# EAGLE schematic FECIW5SIN365UPQ (EAGLE 7.5.0)
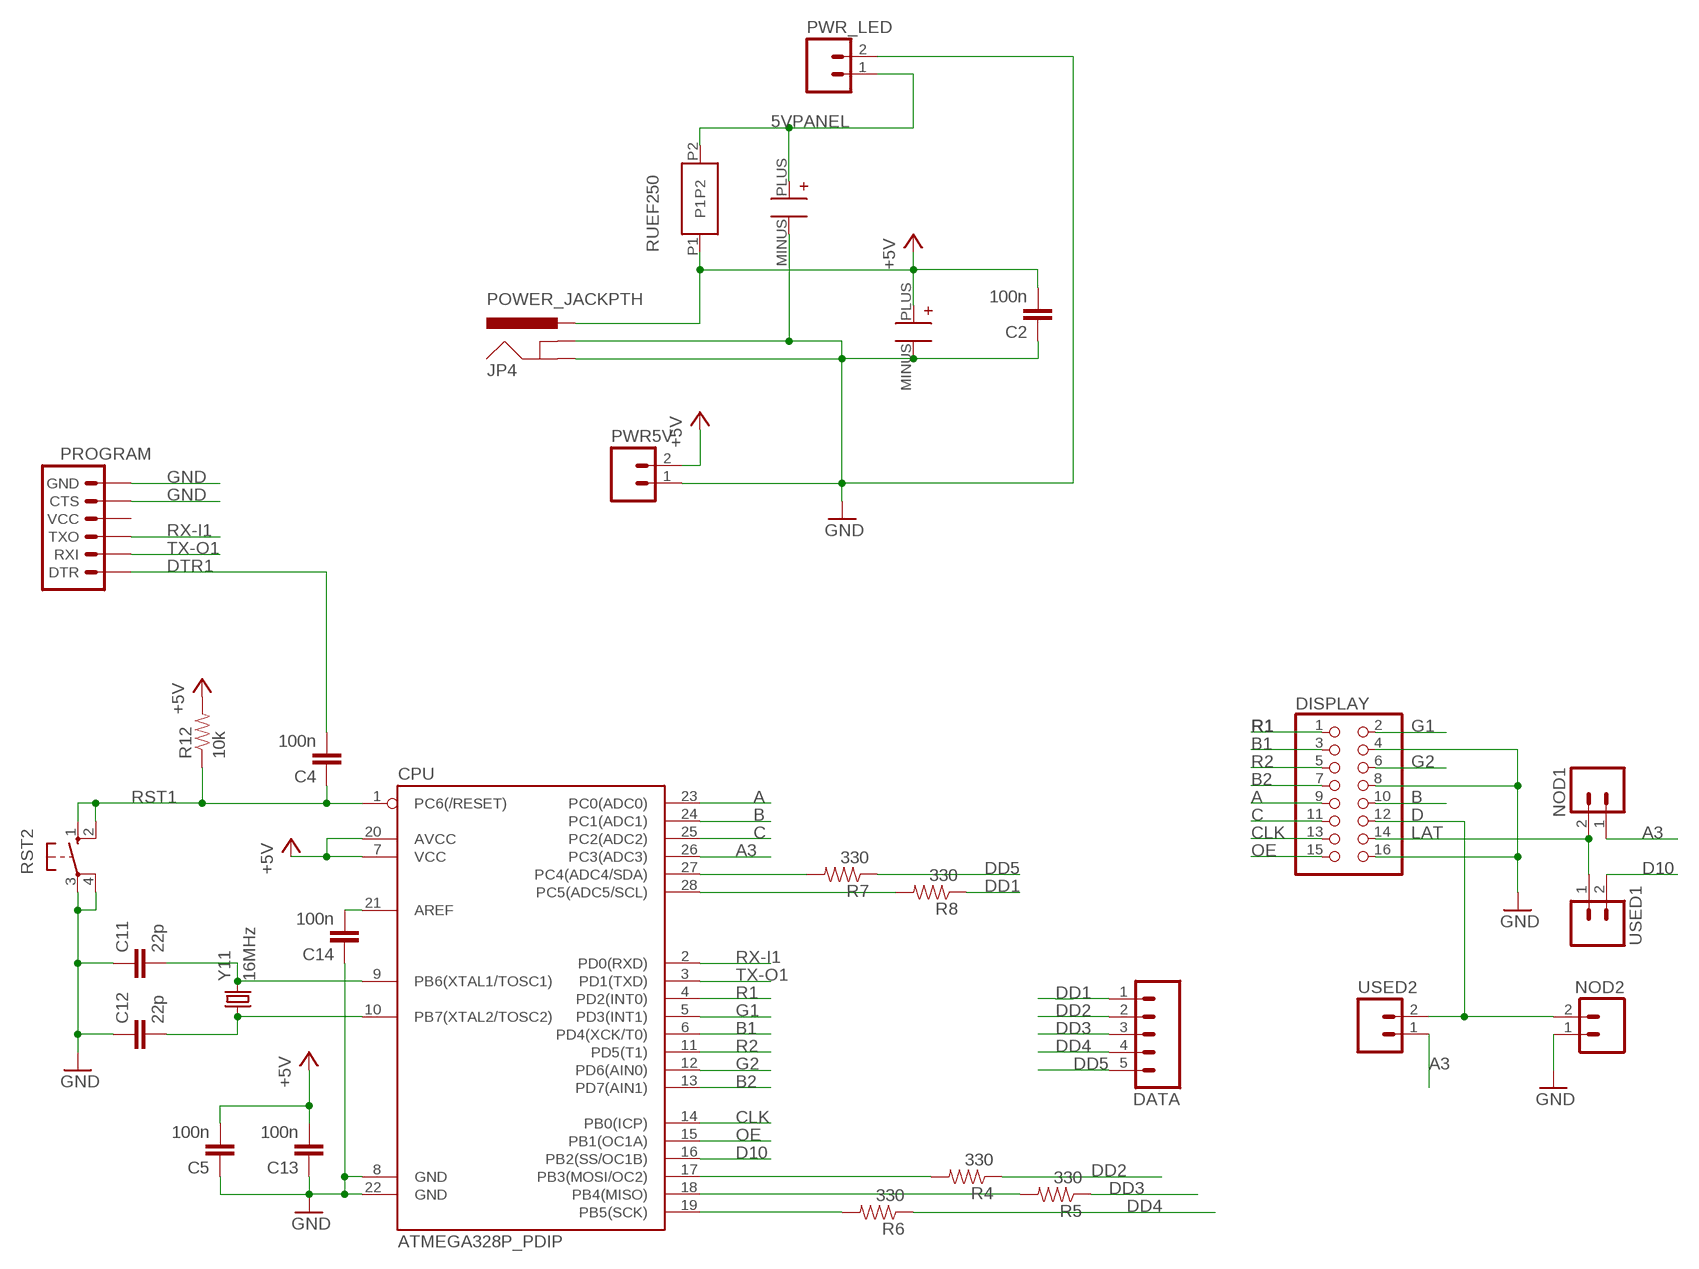
[diagram p0: schematic, sheet 1]

## Parts
C1  EEU-FR1C471B  [EEU-FR1C471B]
C2  100n  C-EU025-024X044  [C025-024X044]
C4  100n  C-EU025-024X044  [C025-024X044]
C5  100n  C-EU025-024X044  [C025-024X044]
C7  EEU-FR1C471B  [EEU-FR1C471B]
C11  22p  C-EU025-024X044  [C025-024X044]
C12  22p  C-EU025-024X044  [C025-024X044]
C13  100n  C-EU025-024X044  [C025-024X044]
C14  100n  C-EU025-024X044  [C025-024X044]
CPU  ATMEGA328P_PDIP  [DIL28-3]
DATA  M05PTH  [1X05]
DISPLAY  PINHD-2X8  [2X08]
JP4  POWER_JACKPTH  [POWER_JACK_PTH]
NOD1  M02PTH  [1X02]
NOD2  M02PTH  [1X02]
PROGRAM  ARDUINO_SERIAL_PROGRAMPTH  [1X06]
PWR5V  M02PTH  [1X02]
PWR_LED  M023.5MM  [SCREWTERMINAL-3.5MM-2]
R4  330  RESISTORAXIAL-0.3  [AXIAL-0.3]
R5  330  RESISTORAXIAL-0.3  [AXIAL-0.3]
R6  330  RESISTORAXIAL-0.3  [AXIAL-0.3]
R7  330  RESISTORAXIAL-0.3  [AXIAL-0.3]
R8  330  RESISTORAXIAL-0.3  [AXIAL-0.3]
R12  10k  RESISTORAXIAL-0.3  [AXIAL-0.3]
RST2  10-XX  [B3F-10XX]
RUEF250  RUEF250U  [RUEF250U]
USED1  M02PTH  [1X02]
USED2  M02PTH  [1X02]
Y11  16MHz  CRYSTALHC49US  [HC49US]

## Nets
5VPANEL [SUPPLYP]: C7.PLUS PWR_LED.1 RUEF250.P2
+5V [SUPPLYP]: C1.PLUS C2.2 C5.2 C13.2 CPU.7(VCC) CPU.20(AVCC) JP4.PWR PWR5V.2 R12.P$2 RUEF250.P1
A: CPU.23(PC0(ADC0)) DISPLAY.9
A3: CPU.26(PC3(ADC3)) NOD1.1 USED2.1
B: CPU.24(PC1(ADC1)) DISPLAY.10
B1: CPU.6(PD4(XCK/T0)) DISPLAY.3
B2: CPU.13(PD7(AIN1)) DISPLAY.7
C: CPU.25(PC2(ADC2)) DISPLAY.11
CLK: CPU.14(PB0(ICP)) DISPLAY.13
D: DISPLAY.12 NOD2.2 USED2.2
D10: CPU.16(PB2(SS/OC1B)) USED1.2
DD1: DATA.1 R8.P$1
DD2: DATA.2 R4.P$1
DD3: DATA.3 R5.P$1
DD4: DATA.4 R6.P$1
DD5: DATA.5 R7.P$1
DTR1: C4.2 PROGRAM.1(DTR)
G1: CPU.5(PD3(INT1)) DISPLAY.2
G2: CPU.12(PD6(AIN0)) DISPLAY.6
GND [SUPPLY]: C1.MINUS C2.1 C5.1 C7.MINUS C11.1 C12.1 C13.1 C14.1 CPU.8(GND) CPU.22(GND) DISPLAY.4 DISPLAY.8 DISPLAY.16 JP4.GND JP4.GNDBREAK NOD2.1 PROGRAM.5(CTS) PROGRAM.6(GND) PWR5V.1 PWR_LED.2 RST2.3(P) RST2.4(P1)
LAT: DISPLAY.14 NOD1.2 USED1.1
N$1 [OSC]: C11.2 CPU.9(PB6(XTAL1/TOSC1)) Y11.2
N$2 [OSC]: C12.2 CPU.10(PB7(XTAL2/TOSC2)) Y11.1
N$6: CPU.19(PB5(SCK)) R6.P$2
N$7: CPU.18(PB4(MISO)) R5.P$2
N$8: CPU.17(PB3(MOSI/OC2)) R4.P$2
N$10: CPU.27(PC4(ADC4/SDA)) R7.P$2
N$11: CPU.28(PC5(ADC5/SCL)) R8.P$2
N$14: C14.2 CPU.21(AREF)
OE: CPU.15(PB1(OC1A)) DISPLAY.15
R1: CPU.4(PD2(INT0)) DISPLAY.1
R2: CPU.11(PD5(T1)) DISPLAY.5
RST1: C4.1 CPU.1(PC6(/RESET)) R12.P$1 RST2.1(S) RST2.2(S1)
RX-I1: CPU.2(PD0(RXD)) PROGRAM.3(TXO)
TX-O1: CPU.3(PD1(TXD)) PROGRAM.2(RXI)
Unconnected: PROGRAM.4(VCC)

## Library data of the parts
C1 C7 = my:EEU-FR1C471B
C2 C4 C5 C11-C14 = rcl:C-EU: CAPACITOR, European symbol
CPU = SparkFun-DigitalIC:ATMEGA328P_PDIP: uC used in the Arduino 32kb flash, 1k EEPROM, 2k SRAM This is the through-hole version of this chip.
DATA = SparkFun-Connectors:M05: Header 5 Standard 5-pin 0.1" header. Use with straight break away headers (SKU : PRT-00116), right angle break away headers (PRT-00553), swiss pins (PRT-00743), machine pins (PRT-00117), and female headers (PRT-00115). Molex polarized connector foot print use with SKU : PRT-08230 with associated crimp pins and housings.
DISPLAY = pinhead:PINHD-2X8: PIN HEADER
JP4 = SparkFun-Connectors:POWER_JACK: Power Jack This is the standard 5.5mm barrel jack for power. The PTH is the most common, proven, reliable, footprint. The Slot footprint only works if the mill layer is transmitted to the PCB fab house so be warned. Mating wall wart : TOL-00298 (and others); PROD_ID: CONN-08197
NOD1 NOD2 PWR5V USED1 USED2 = SparkFun-Connectors:M02: Standard 2-pin 0.1" header. Use with - straight break away headers ( PRT-00116) - right angle break away headers (PRT-00553) - swiss pins (PRT-00743) - machine pins (PRT-00117) - female headers (PRT-00115) Molex polarized connector foot print use with: PRT-08233 with associated crimp pins and housings. 2.54_SCREWTERM for use with PRT-10571. 3.5mm Screw Terminal footprints for PRT-08084 5mm Screw Terminal footprints for use with PRT-08432
PROGRAM = SparkFun-Connectors:ARDUINO_SERIAL_PROGRAM: FTDI connector footprints
PWR_LED = SparkFun-Connectors:M02: Standard 2-pin 0.1" header. Use with - straight break away headers ( PRT-00116) - right angle break away headers (PRT-00553) - swiss pins (PRT-00743) - machine pins (PRT-00117) - female headers (PRT-00115) Molex polarized connector foot print use with: PRT-08233 with associated crimp pins and housings. 2.54_SCREWTERM for use with PRT-10571. 3.5mm Screw Terminal footprints for PRT-08084 5mm Screw Terminal footprints for use with PRT-08432; PROD_ID: CONN-08399
R4-R8 R12 = SparkFun-Passives:RESISTOR: Resistor Basic schematic elements and footprints for 0603, 1206, and PTH resistors.
RST2 = switch-omron:10-XX: OMRON SWITCH; MPN: B3F-1000; OC_FARNELL: 176432; OC_NEWARK: 36M3542
RUEF250 = my:RUEF250U
Y11 = SparkFun-FreqCtrl:CRYSTAL: Various standard crystals. Proven footprints.

## Net classes
0 default: width 0.254 mm, drill 0.381 mm, clearance 0.254 mm
1 SUPPLY: width 0.762 mm, drill 0.762 mm, clearance 0.254 mm to class 0, clearance 0.254 mm
2 SUPPLYP: width 0.762 mm, drill 0.762 mm, clearance 0.254 mm to class 0, clearance 0.254 mm to class 1, clearance 0.254 mm
3 OSC: width 0.254 mm, drill 0.381 mm, clearance 0.381 mm to class 0, clearance 0.381 mm to class 1, clearance 0.381 mm to class 2, clearance 0.381 mm